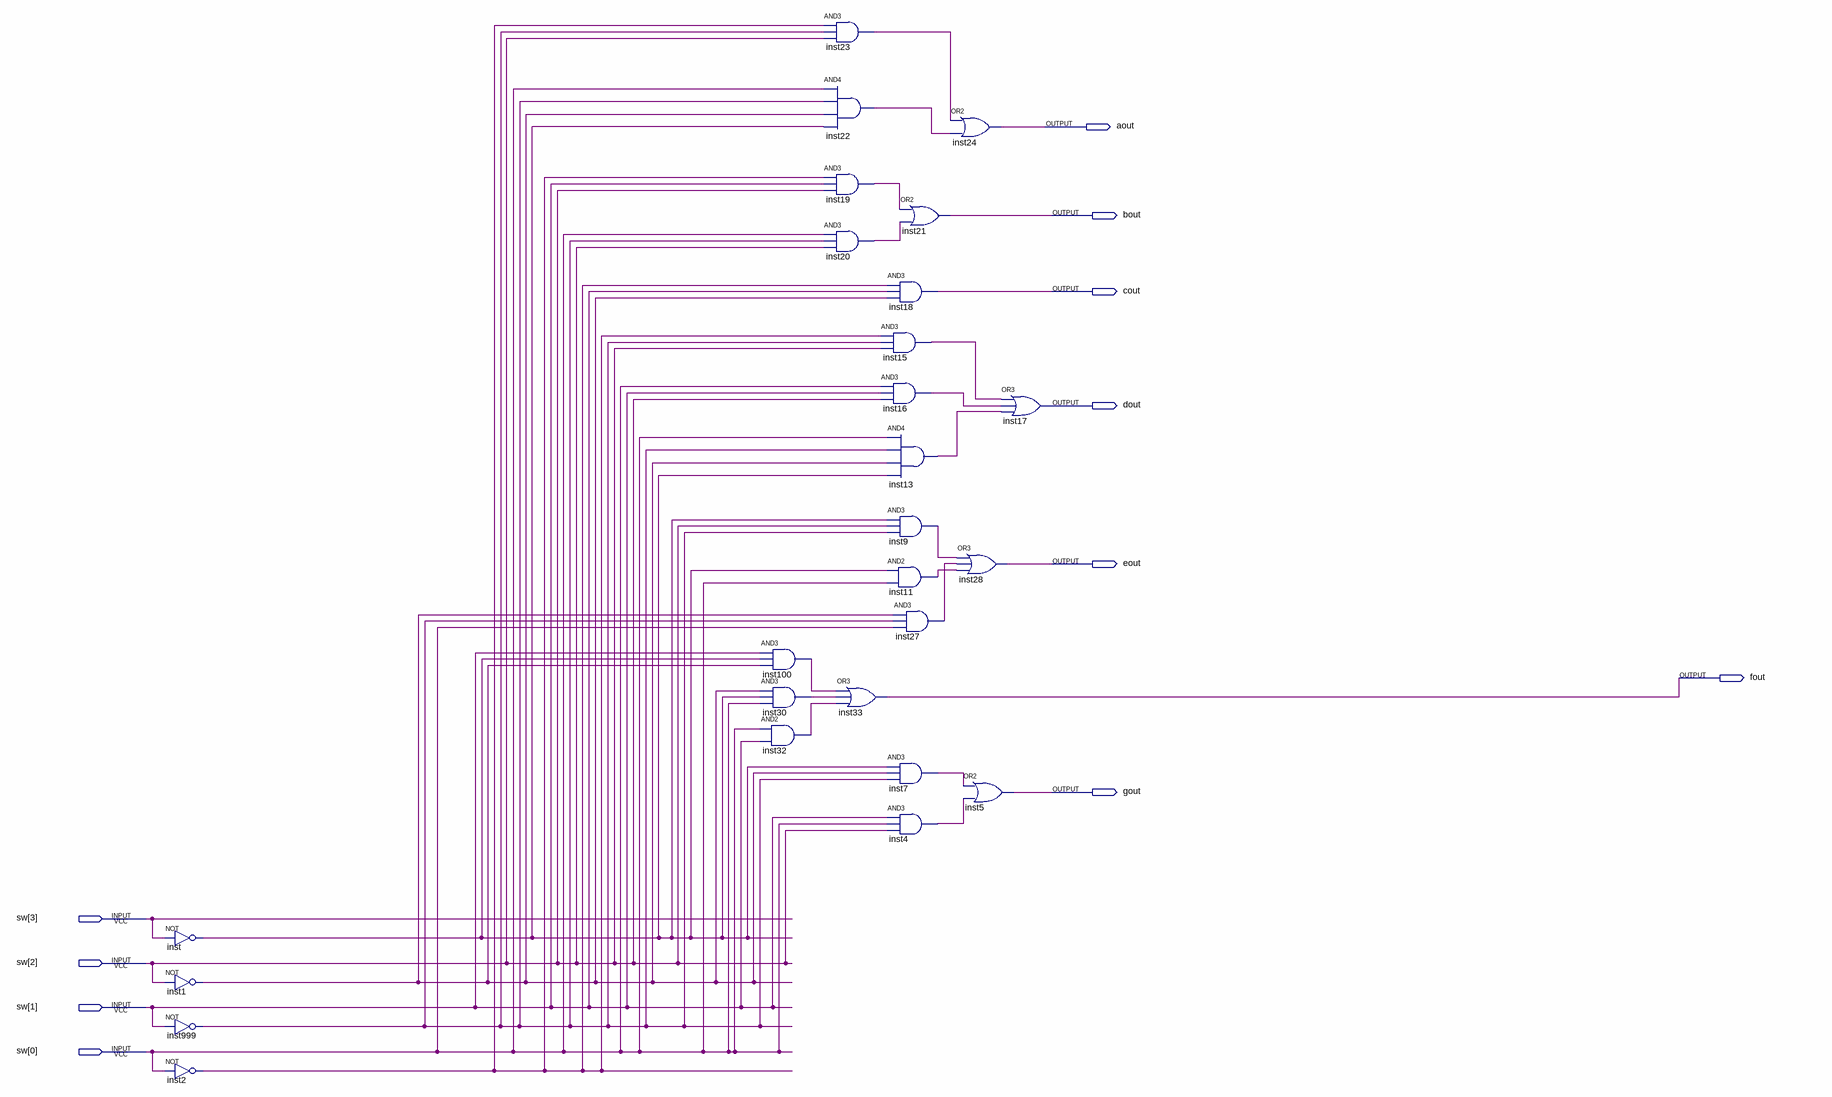
[diagram p0: schematic sheet]
// Quartus schematic display7.bdf as structural Verilog: 26 symbols, 11 pins
module display7 (
  input  [3:0] sw,
  output aout,
  output bout,
  output cout,
  output dout,
  output eout,
  output fout,
  output gout
);

  wire inst1_out, inst2_out, inst4_out, inst7_out, inst9_out, inst11_out, inst13_out, inst15_out, inst16_out,
       inst19_out, inst20_out, inst22_out, inst23_out, inst27_out, inst30_out, inst32_out, inst100_out,
       inst999_out, inst_out;

  not inst (inst_out, sw[3]);
  not inst1 (inst1_out, sw[2]);
  not inst999 (inst999_out, sw[1]);
  not inst2 (inst2_out, sw[0]);
  and inst100 (inst100_out, sw[1], inst_out, inst1_out);
  and inst30 (inst30_out, inst1_out, inst_out, sw[0]);
  and inst32 (inst32_out, sw[0], sw[1]);
  and inst23 (inst23_out, inst2_out, inst999_out, sw[2]);
  and inst22 (inst22_out, sw[0], inst999_out, inst1_out, inst_out);
  and inst19 (inst19_out, inst2_out, sw[1], sw[2]);
  and inst20 (inst20_out, sw[0], inst999_out, sw[2]);
  or inst33 (fout, inst100_out, inst30_out, inst32_out);
  or inst21 (bout, inst19_out, inst20_out);
  and inst18 (cout, inst2_out, sw[1], inst1_out);
  and inst15 (inst15_out, inst2_out, inst999_out, sw[2]);
  and inst16 (inst16_out, sw[0], sw[1], sw[2]);
  and inst13 (inst13_out, sw[0], inst999_out, inst1_out, inst_out);
  and inst9 (inst9_out, inst_out, sw[2], inst999_out);
  and inst11 (inst11_out, inst_out, sw[0]);
  and inst27 (inst27_out, inst1_out, inst999_out, sw[0]);
  and inst7 (inst7_out, inst_out, inst1_out, inst999_out);
  and inst4 (inst4_out, sw[1], sw[0], sw[2]);
  or inst24 (aout, inst23_out, inst22_out);
  or inst17 (dout, inst15_out, inst16_out, inst13_out);
  or inst28 (eout, inst9_out, inst27_out, inst11_out);
  or inst5 (gout, inst7_out, inst4_out);
endmodule
